# Altium schematic sheet EMG-circuit.SchDoc
size A3; SheetNumber: 1; SheetTotal: 1; SPICEModelCacheKQYJZISL: <root> / <DocumentId>KQYJZISL</DocumentId> / <CacheFrame Number="0"> / <Model Name="cap" Kind="MDL"> / <Text>*Default semiconductor capacitor / .MODEL CAP C()</Text> / </Model> / </CacheFrame> / </root>
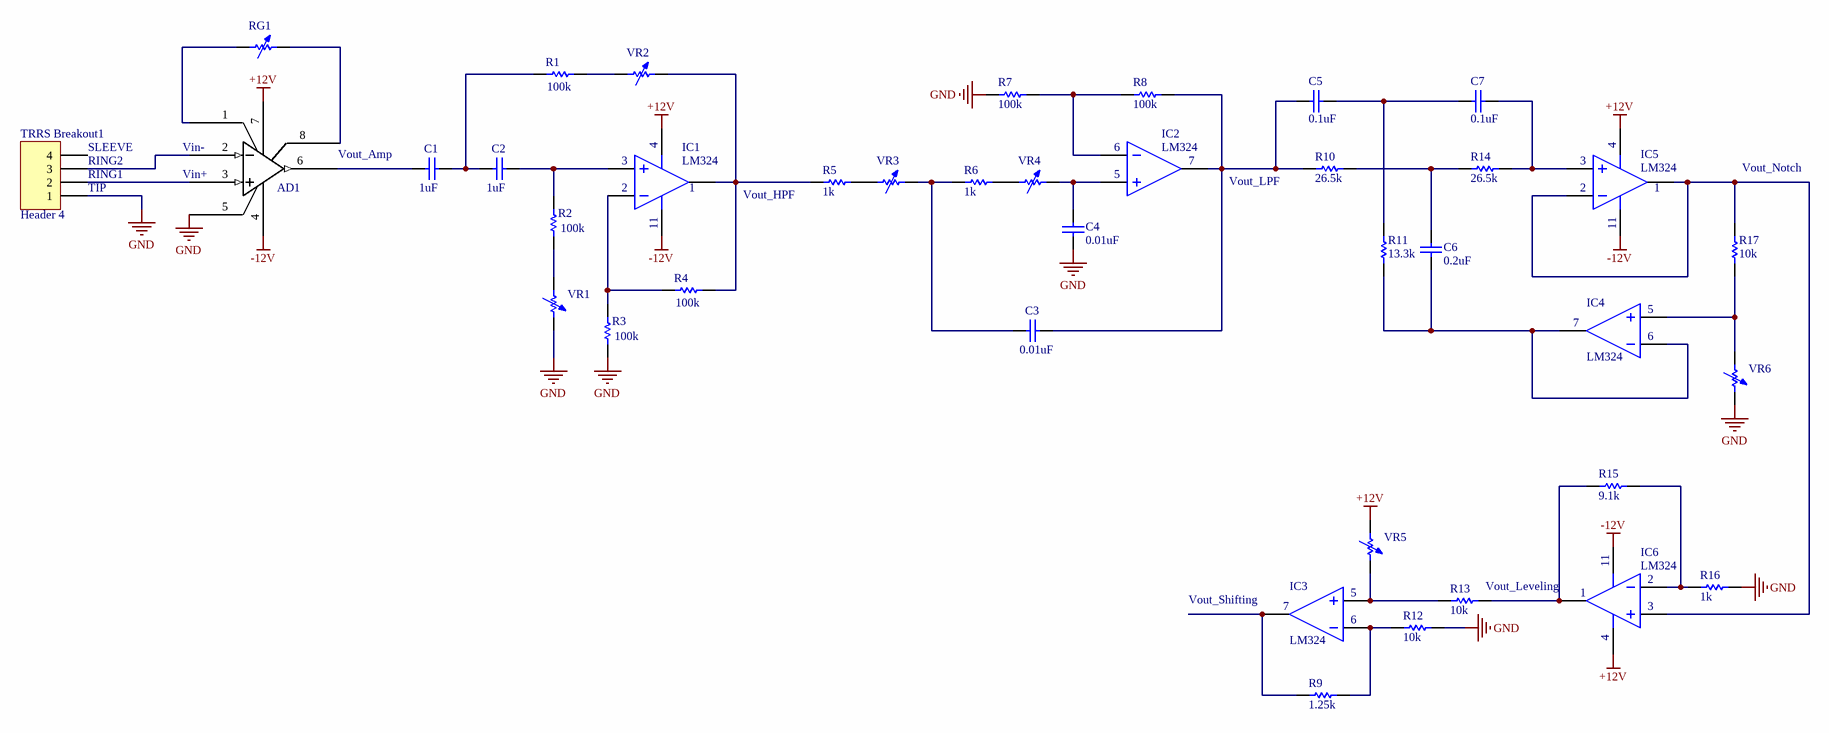
[diagram p0: EMG-circuit.SchDoc]

## Parts
AD1  [Instrumentation amplifier]8pin-DIP-10.92*7.11  [AD620AN-8pin-10.92*7.11]  (value not drawn)
C1  value 1uF  [RAD-0.3]  (hidden comment: Cap)
C2  value 1uF  [RAD-0.3]  (hidden comment: Cap)
C3  value 0.01uF  [RAD-0.3]  (hidden comment: Cap)
C4  value 0.01uF  [RAD-0.3]  (hidden comment: Cap)
C5  value 0.1uF  [RAD-0.3]  (hidden comment: Cap)
C6  value 0.2uF  [RAD-0.3]  (hidden comment: Cap)
C7  value 0.1uF  [RAD-0.3]  (hidden comment: Cap)
IC1  LM324
IC2  LM324
IC3  LM324
IC4  LM324
IC5  LM324
IC6  LM324
R1  value 100k  [AXIAL-0.3]  (hidden comment: Res1)
R2  value 100k  [AXIAL-0.3]  (hidden comment: Res1)
R3  value 100k  [AXIAL-0.3]  (hidden comment: Res1)
R4  value 100k  [AXIAL-0.3]  (hidden comment: Res1)
R5  value 1k  (hidden comment: Resistor)
R6  value 1k  (hidden comment: Resistor)
R7  value 100k  (hidden comment: Resistor)
R8  value 100k  (hidden comment: Resistor)
R9  value 1.25k  (hidden comment: Resistor)
R10  value 26.5k  (hidden comment: Resistor)
R11  value 13.3k  (hidden comment: Resistor)
R12  value 10k  (hidden comment: Resistor)
R13  value 10k  (hidden comment: Resistor)
R14  value 26.5k  (hidden comment: Resistor)
R15  value 9.1k  (hidden comment: Resistor)
R16  value 1k  (hidden comment: Resistor)
R17  value 10k  (hidden comment: Resistor)
RG1  Res Adj1  [AXIAL-0.7]  (value not drawn)
TRRS_Breakout1  Header 4  [HDR1X4]
VR1  Res Adj1  [AXIAL-0.7]  (value not drawn)
VR2  Res Adj1  [AXIAL-0.7]  (value not drawn)
VR3  Res Adj1  [AXIAL-0.7]  (value not drawn)
VR4  Res Adj1  [AXIAL-0.7]  (value not drawn)
VR5  Res Adj1  [AXIAL-0.7]  (value not drawn)
VR6  Res Adj1  [AXIAL-0.7]  (value not drawn)

## Nets
+12V: AD1.7(+Vs) IC1.5(V-) IC5.5(V-) IC6.5(V-) VR5.1
-12V: AD1.4(-Vs) IC1.4(V+) IC5.4(V+) IC6.4(V+)
GND: AD1.5(Ref) C4.2 R3.2 R7.1 R12.1 R16.1 TRRS_Breakout1.1 VR1.2 VR6.2
NetAD1_1: AD1.1(Rg) RG1.1
NetAD1_2: AD1.2(Vin-) TRRS_Breakout1.3
NetAD1_3: AD1.3(Vin+) TRRS_Breakout1.2
NetAD1_6: AD1.6(Output) C1.1
NetAD1_8: AD1.8(Rg) RG1.2
NetC1_2: C1.2 C2.1 R1.2
NetC2_2: C2.2 IC1.2(IN+) R2.2
NetC3_1: C3.1 R6.1 VR3.2
NetC3_2: C3.2 C5.2 IC2.3(OUT) R8.2 R10.1
NetC4_1: C4.1 IC2.2(IN+) VR4.2
NetC5_1: C5.1 C7.2 R11.1
NetC6_1: C6.1 IC4.1(IN-) IC4.3(OUT) R11.2
NetC6_2: C6.2 R10.2 R14.1
NetC7_1: C7.1 IC5.2(IN+) R14.2
NetIC1_1: IC1.1(IN-) R3.1 R4.1
NetIC1_3: IC1.3(OUT) R4.2 R5.1 VR2.2
NetIC2_1: IC2.1(IN-) R7.2 R8.1
NetIC3_1: IC3.1(IN-) R9.1 R12.2
NetIC3_2: IC3.2(IN+) R13.2 VR5.2
NetIC3_3: IC3.3(OUT) R9.2
NetIC4_2: IC4.2(IN+) R17.2 VR6.1
NetIC5_1: IC5.1(IN-) IC5.3(OUT) IC6.2(IN+) R17.1
NetIC6_1: IC6.1(IN-) R15.1 R16.2
NetIC6_3: IC6.3(OUT) R13.1 R15.2
NetR1_1: R1.1 VR2.1
NetR2_1: R2.1 VR1.1
NetR5_2: R5.2 VR3.1
NetR6_2: R6.2 VR4.1

Not connected (* = marked no-connect by the designer): TRRS_Breakout1 4

## Notes on the sheet
- (near TRRS_Breakout1) RING2
- (near TRRS_Breakout1) SLEEVE
- (near AD1) Vin-
- Vout_Amp
- (near IC1) 3
- (near IC1) 4
- (near IC2) 6
- (near IC2) 7
- (near IC5) 3
- (near IC5) 4
- (near TRRS_Breakout1) TIP
- (near TRRS_Breakout1) RING1
- (near AD1) Vin+
- (near IC1) 2
- (near IC1) 11
- (near IC1) 1
- (near R5) Vout_HPF
- (near IC2) 5
- Vout_LPF
- (near IC5) 2
- (near IC5) 11
- (near IC5) 1
- Vout_Notch
- (near IC4) 7
- (near IC4) 5
- (near IC4) 6
- (near IC6) 11
- (near IC3) Vout_Shifting
- (near IC3) 7
- (near IC3) 5
- (near IC3) 6
- (near R13) Vout_Leveling
- (near IC6) 1
- (near IC6) 4
- (near IC6) 2
- (near IC6) 3

## Library data of the parts
AD1 = OP
C1-C7 = Cap: Capacitor; Published: 8-Jun-2000; LatestRevisionDate: 17-Jul-2002; LatestRevisionNote: Re-released for DXP Platform.; PackageReference: RAD-0.3; Publisher: Altium Limited; PackageDescription: Radial Cap, Thru-Hole; 2 Leads; 0.3 in Pin Spacing
IC1 IC5 IC6 = OpAmp with power terminals: Ideal Operational Amplifier; SimulationGenericComponent: True; GAIN: 1Meg
IC2-IC4 = OpAmp: Ideal Operational Amplifier; SimulationGenericComponent: True; GAIN: 1Meg
R1-R4 = Res1: Resistor; Published: 8-Jun-2000; LatestRevisionDate: 17-Jul-2002; LatestRevisionNote: Re-released for DXP Platform.; PackageReference: AXIAL-0.3; Publisher: Altium Limited; PackageDescription: Axial Device, Thru-Hole; 2 Leads; 0.3 in Pin Spacing
R5-R17 = Resistor: TC1: 0; SimulationGenericComponent: True; TC2: 0
RG1 = Res Adj1: Variable Resistor; Value: 1k; Set Position: 0.5; Published: 8-Jun-2000; LatestRevisionDate: 17-Jul-2002; LatestRevisionNote: Re-released for DXP Platform.; PackageReference: AXIAL-0.7; Publisher: Altium Limited; PackageDescription: Axial Device, Thru-Hole; 2 Leads; 0.7 in Pin Spacing
TRRS_Breakout1 = Header 4: Header, 4-Pin; LatestRevisionDate: 17-Jul-2002; LatestRevisionNote: Re-released for DXP Platform.; Publisher: Altium Limited
VR1 VR2 = Res Adj1: Variable Resistor; Value: 500k; Set Position: 0.5; Published: 8-Jun-2000; LatestRevisionDate: 17-Jul-2002; LatestRevisionNote: Re-released for DXP Platform.; PackageReference: AXIAL-0.7; Publisher: Altium Limited; PackageDescription: Axial Device, Thru-Hole; 2 Leads; 0.7 in Pin Spacing
VR3-VR6 = Res Adj1: Variable Resistor; Value: 100k; Set Position: 0.5; Published: 8-Jun-2000; LatestRevisionDate: 17-Jul-2002; LatestRevisionNote: Re-released for DXP Platform.; PackageReference: AXIAL-0.7; Publisher: Altium Limited; PackageDescription: Axial Device, Thru-Hole; 2 Leads; 0.7 in Pin Spacing